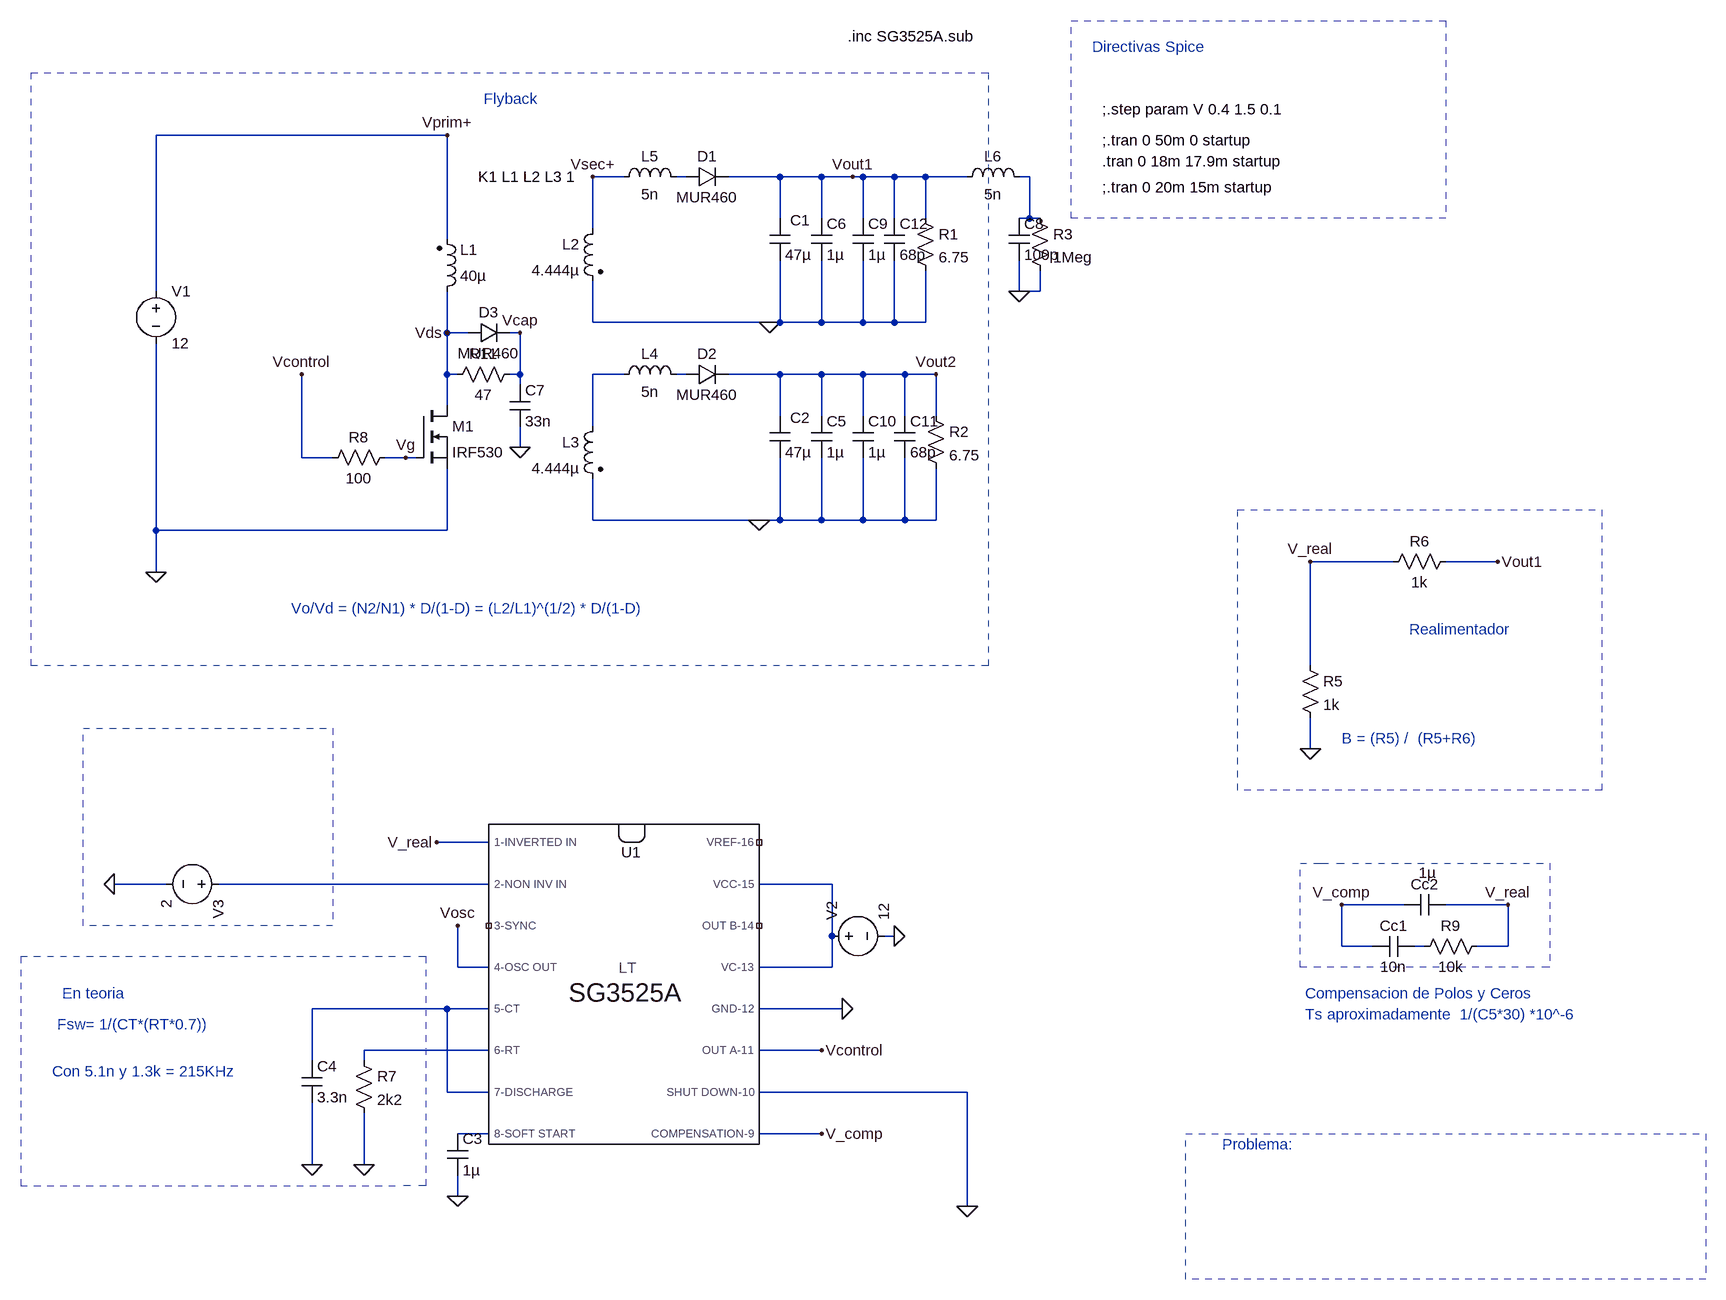
[diagram p0: schematic FlyBack_CL_realimentado_vref.asc]
FlyBack_CL_realimentado_vref.asc, the LTspice schematic file:
Version 4
SHEET 1 2728 2080
WIRE 48 -240 -400 -240
WIRE 320 -176 272 -176
WIRE 416 -176 400 -176
WIRE 560 -176 480 -176
WIRE 624 -176 560 -176
WIRE 672 -176 624 -176
WIRE 688 -176 672 -176
WIRE 736 -176 688 -176
WIRE 784 -176 736 -176
WIRE 848 -176 784 -176
WIRE 944 -176 928 -176
WIRE 560 -112 560 -176
WIRE 624 -112 624 -176
WIRE 688 -112 688 -176
WIRE 736 -112 736 -176
WIRE 784 -112 784 -176
WIRE 944 -112 944 -176
WIRE 944 -112 928 -112
WIRE 960 -112 944 -112
WIRE 272 -96 272 -176
WIRE 48 -80 48 -240
WIRE -400 0 -400 -240
WIRE 928 0 928 -48
WIRE 960 0 960 -32
WIRE 960 0 928 0
WIRE 272 48 272 -16
WIRE 544 48 272 48
WIRE 560 48 560 -48
WIRE 560 48 544 48
WIRE 624 48 624 -48
WIRE 624 48 560 48
WIRE 688 48 688 -48
WIRE 688 48 624 48
WIRE 736 48 736 -48
WIRE 736 48 688 48
WIRE 784 48 784 -32
WIRE 784 48 736 48
WIRE 48 64 48 0
WIRE 80 64 48 64
WIRE 160 64 144 64
WIRE 48 128 48 64
WIRE 64 128 48 128
WIRE 160 128 160 64
WIRE 160 128 144 128
WIRE 320 128 272 128
WIRE 416 128 400 128
WIRE 560 128 480 128
WIRE 624 128 560 128
WIRE 688 128 624 128
WIRE 752 128 688 128
WIRE 800 128 752 128
WIRE 160 144 160 128
WIRE 48 176 48 128
WIRE 560 192 560 128
WIRE 624 192 624 128
WIRE 688 192 688 128
WIRE 752 192 752 128
WIRE 800 192 800 128
WIRE 272 208 272 128
WIRE 160 240 160 208
WIRE -176 256 -176 128
WIRE -128 256 -176 256
WIRE -16 256 -48 256
WIRE 0 256 -16 256
WIRE 272 352 272 288
WIRE 528 352 272 352
WIRE 560 352 560 256
WIRE 560 352 528 352
WIRE 624 352 624 256
WIRE 624 352 560 352
WIRE 688 352 688 256
WIRE 688 352 624 352
WIRE 752 352 752 256
WIRE 752 352 688 352
WIRE 800 352 800 272
WIRE 800 352 752 352
WIRE -400 368 -400 80
WIRE 48 368 48 272
WIRE 48 368 -400 368
WIRE 1504 416 1376 416
WIRE 1664 416 1584 416
WIRE -400 432 -400 368
WIRE 1376 576 1376 416
WIRE 1376 704 1376 656
WIRE 112 848 32 848
WIRE -384 912 -464 912
WIRE 112 912 -304 912
WIRE 640 912 528 912
WIRE 1520 944 1424 944
WIRE 1680 944 1584 944
WIRE 640 992 640 912
WIRE 736 992 720 992
WIRE 1424 1008 1424 944
WIRE 1472 1008 1424 1008
WIRE 1552 1008 1536 1008
WIRE 1680 1008 1680 944
WIRE 1680 1008 1632 1008
WIRE 64 1040 64 976
WIRE 112 1040 64 1040
WIRE 640 1040 640 992
WIRE 640 1040 528 1040
WIRE 48 1104 -160 1104
WIRE 112 1104 48 1104
WIRE 656 1104 528 1104
WIRE 112 1168 -80 1168
WIRE 624 1168 528 1168
WIRE -160 1184 -160 1104
WIRE -80 1184 -80 1168
WIRE 48 1232 48 1104
WIRE 112 1232 48 1232
WIRE 848 1232 528 1232
WIRE 112 1296 64 1296
WIRE 624 1296 528 1296
WIRE -160 1344 -160 1248
WIRE -80 1344 -80 1264
WIRE 64 1392 64 1360
WIRE 848 1408 848 1232
FLAG -400 432 0
FLAG 672 -176 Vout1
FLAG 800 128 Vout2
FLAG 656 1104 0
FLAG -464 912 0
FLAG 1376 704 0
FLAG 1664 416 Vout1
FLAG 624 1168 Vcontrol
FLAG 848 1408 0
FLAG 64 1392 0
FLAG -80 1344 0
FLAG -160 1344 0
FLAG 736 992 0
FLAG 32 848 V_real
FLAG 1376 416 V_real
FLAG 1680 944 V_real
FLAG -176 128 Vcontrol
FLAG 624 1296 V_comp
FLAG 1424 944 V_comp
FLAG 160 240 0
FLAG 544 48 0
FLAG 528 352 0
FLAG 272 -176 Vsec+
FLAG 48 64 Vds
FLAG 160 64 Vcap
FLAG 48 -240 Vprim+
FLAG 64 976 Vosc
FLAG -16 256 Vg
FLAG 928 0 0
SYMBOL nmos 0 176 R0
SYMATTR InstName M1
SYMATTR Value IRF530
SYMBOL diode 416 -160 R270
WINDOW 0 32 32 VTop 2
WINDOW 3 0 32 VBottom 2
SYMATTR InstName D1
SYMATTR Value MUR460
SYMBOL voltage -400 -16 R0
WINDOW 123 0 0 Left 0
WINDOW 39 0 0 Left 0
SYMATTR InstName V1
SYMATTR Value 12
SYMBOL res -32 240 R90
WINDOW 0 0 56 VBottom 2
WINDOW 3 32 56 VTop 2
SYMATTR InstName R8
SYMATTR Value 100
SYMBOL cap 544 -112 R0
WINDOW 0 32 3 Left 2
SYMATTR InstName C1
SYMATTR Value 47µ
SYMATTR SpiceLine Rser=0.1
SYMBOL res 768 -128 R0
SYMATTR InstName R1
SYMATTR Value 6.75
SYMBOL ind2 32 16 M180
WINDOW 0 36 80 Left 2
WINDOW 3 36 40 Left 2
SYMATTR InstName L1
SYMATTR Value 40µ
SYMATTR Type ind
SYMBOL ind2 288 -112 M0
SYMATTR InstName L2
SYMATTR Value 4.444µ
SYMATTR Type ind
SYMBOL diode 416 144 R270
WINDOW 0 32 32 VTop 2
WINDOW 3 0 32 VBottom 2
SYMATTR InstName D2
SYMATTR Value MUR460
SYMBOL cap 544 192 R0
WINDOW 0 32 3 Left 2
SYMATTR InstName C2
SYMATTR Value 47µ
SYMATTR SpiceLine Rser=0.1
SYMBOL res 784 176 R0
SYMATTR InstName R2
SYMATTR Value 6.75
SYMBOL ind2 288 192 M0
SYMATTR InstName L3
SYMATTR Value 4.444µ
SYMATTR Type ind
SYMBOL res 1600 400 R90
WINDOW 0 0 56 VBottom 2
WINDOW 3 32 56 VTop 2
SYMATTR InstName R6
SYMATTR Value 1k
SYMBOL cap 48 1296 R0
SYMATTR InstName C3
SYMATTR Value 1µ
SYMBOL res -96 1168 R0
SYMATTR InstName R7
SYMATTR Value 2k2
SYMBOL cap -176 1184 R0
SYMATTR InstName C4
SYMATTR Value 3.3n
SYMBOL SG3525A 256 944 R0
SYMATTR InstName U1
SYMATTR Value SG3525A
SYMBOL cap 1536 992 R90
WINDOW 0 0 32 VBottom 2
WINDOW 3 32 32 VTop 2
SYMATTR InstName Cc1
SYMATTR Value 10n
SYMBOL res 1648 992 R90
WINDOW 0 0 56 VBottom 2
WINDOW 3 32 56 VTop 2
SYMATTR InstName R9
SYMATTR Value 10k
SYMBOL cap 1584 928 R90
WINDOW 0 0 32 VBottom 2
WINDOW 3 -49 28 VTop 2
SYMATTR InstName Cc2
SYMATTR Value 1µ
SYMBOL voltage 624 992 R270
WINDOW 123 0 0 Left 0
WINDOW 39 0 0 Left 0
SYMATTR InstName V2
SYMATTR Value 12
SYMBOL res 1360 560 R0
SYMATTR InstName R5
SYMATTR Value 1k
SYMBOL diode 80 80 R270
WINDOW 0 32 32 VTop 2
WINDOW 3 0 32 VBottom 2
SYMATTR InstName D3
SYMATTR Value MUR460
SYMBOL cap 144 144 R0
SYMATTR InstName C7
SYMATTR Value 33n
SYMBOL res 160 112 R90
WINDOW 0 0 56 VBottom 2
WINDOW 3 32 56 VTop 2
SYMATTR InstName R11
SYMATTR Value 47
SYMBOL cap 608 192 R0
SYMATTR InstName C5
SYMATTR Value 1µ
SYMATTR SpiceLine Rser=0.1
SYMBOL cap 608 -112 R0
SYMATTR InstName C6
SYMATTR Value 1µ
SYMATTR SpiceLine Rser=0.1
SYMBOL voltage -288 912 R90
WINDOW 123 0 0 Left 0
WINDOW 39 0 0 Left 0
SYMATTR InstName V3
SYMATTR Value 2
SYMBOL ind 304 144 R270
WINDOW 0 32 56 VTop 2
WINDOW 3 5 56 VBottom 2
SYMATTR InstName L4
SYMATTR Value 5n
SYMATTR SpiceLine Rser=0.016
SYMBOL ind 304 -160 R270
WINDOW 0 32 56 VTop 2
WINDOW 3 5 56 VBottom 2
SYMATTR InstName L5
SYMATTR Value 5n
SYMATTR SpiceLine Rser=0.016
SYMBOL cap 912 -112 R0
SYMATTR InstName C8
SYMATTR Value 100p
SYMBOL res 944 -128 R0
SYMATTR InstName R3
SYMATTR Value 1Meg
SYMBOL ind 832 -160 R270
WINDOW 0 32 56 VTop 2
WINDOW 3 5 56 VBottom 2
SYMATTR InstName L6
SYMATTR Value 5n
SYMBOL cap 672 -112 R0
SYMATTR InstName C9
SYMATTR Value 1µ
SYMATTR SpiceLine Rser=0.1
SYMBOL cap 672 192 R0
SYMATTR InstName C10
SYMATTR Value 1µ
SYMATTR SpiceLine Rser=0.1
SYMBOL cap 736 192 R0
SYMATTR InstName C11
SYMATTR Value 68p
SYMATTR SpiceLine Rser=0.01
SYMBOL cap 720 -112 R0
SYMATTR InstName C12
SYMATTR Value 68p
SYMATTR SpiceLine Rser=0.01
TEXT -192 488 Left 2 ;Vo/Vd = (N2/N1) * D/(1-D) = (L2/L1)^(1/2) * D/(1-D)
TEXT 96 -176 Left 2 !K1 L1 L2 L3 1
TEXT 1056 -232 Left 2 !;.tran 0 50m 0 startup
TEXT 664 -392 Left 2 !.inc SG3525A.sub
TEXT 1368 1080 Left 2 ;Compensacion de Polos y Ceros
TEXT 1368 1112 Left 2 ;Ts aproximadamente  1/(C5*30) *10^-6
TEXT 1056 -280 Left 2 !;.step param V 0.4 1.5 0.1
TEXT -544 1080 Left 2 ;En teoria
TEXT -552 1128 Left 2 ;Fsw= 1/(CT*(RT*0.7))
TEXT -560 1200 Left 2 ;Con 5.1n y 1.3k = 215KHz
TEXT 1528 520 Left 2 ;Realimentador
TEXT 1424 688 Left 2 ;B = (R5) /  (R5+R6)
TEXT 104 -296 Left 2 ;Flyback
TEXT 1040 -376 Left 2 ;Directivas Spice
TEXT 1240 1312 Left 2 ;Problema:
TEXT 1056 -160 Left 2 !;.tran 0 20m 15m startup
TEXT 1056 -200 Left 2 !.tran 0 18m 17.9m startup
LINE Normal 16 1376 16 1024 2
LINE Normal -608 1376 -32 1376 2
LINE Normal -608 1024 -608 1376 2
LINE Normal -32 1024 -608 1024 2
LINE Normal 1696 1040 1392 1040 2
LINE Normal 1744 880 1744 1040 2
LINE Normal 1440 880 1744 880 2
LINE Normal 1392 880 1440 880 2
LINE Normal 1744 1040 1696 1040 2
LINE Normal 1360 880 1392 880 2
LINE Normal 1360 1040 1360 880 2
LINE Normal 1392 1040 1360 1040 2
LINE Normal 16 1024 -32 1024 2
LINE Normal 16 1376 -32 1376 2
RECTANGLE Normal 1824 768 1264 336 2
RECTANGLE Normal 880 576 -592 -336 2
RECTANGLE Normal -128 976 -512 672 2
RECTANGLE Normal 1584 -112 1008 -416 2
RECTANGLE Normal 1984 1520 1184 1296 2

The netlist it stands for:
* FlyBack_CL_realimentado_vref.asc
M1 Vds Vg 0 0 IRF530
D1 N001 Vout1 MUR460
V1 Vprim+ 0 12
R8 Vg Vcontrol 100
C1 Vout1 0 47µ Rser=0.1
R1 Vout1 0 6.75
L1 Vds Vprim+ 40µ
L2 Vsec+ 0 4.444µ
D2 N004 Vout2 MUR460
C2 Vout2 0 47µ Rser=0.1
R2 Vout2 0 6.75
L3 N003 0 4.444µ
R6 Vout1 V_real 1k
C3 N010 0 1µ
R7 N009 0 2k2
C4 N008 0 3.3n
XU1 V_real N005 NC_01 Vosc N008 N009 N008 N010 V_comp 0 Vcontrol 0 N006 NC_02 N006 NC_03 SG3525A  ; pins 1-INVERTED_IN 2-NON_INV_IN 3-SYNC 4-OSC_OUT 5-CT 6-RT 7-DISCHARGE 8-SOFT_START COMPENSATION-9 SHUT_DOWN-10 OUT_A-11 GND-12 VC-13 OUT_B-14 VCC-15 VREF-16
Cc1 N007 V_comp 10n
R9 V_real N007 10k
Cc2 V_real V_comp 1µ
V2 N006 0 12
R5 V_real 0 1k
D3 Vds Vcap MUR460
C7 Vcap 0 33n
R11 Vcap Vds 47
C5 Vout2 0 1µ Rser=0.1
C6 Vout1 0 1µ Rser=0.1
V3 N005 0 2
L4 N003 N004 5n Rser=0.016
L5 Vsec+ N001 5n Rser=0.016
C8 N002 0 100p
R3 N002 0 1Meg
L6 Vout1 N002 5n
C9 Vout1 0 1µ Rser=0.1
C10 Vout2 0 1µ Rser=0.1
C11 Vout2 0 68p Rser=0.01
C12 Vout1 0 68p Rser=0.01
.model D D
.lib standard.dio
.model NMOS NMOS
.model PMOS PMOS
.lib standard.mos
* Vo/Vd = (N2/N1) * D/(1-D) = (L2/L1)^(1/2) * D/(1-D)
K1 L1 L2 L3 1
;.tran 0 50m 0 startup
.inc SG3525A.sub
* Compensacion de Polos y Ceros
* Ts aproximadamente  1/(C5*30) *10^-6
;.step param V 0.4 1.5 0.1
* En teoria
* Fsw= 1/(CT*(RT*0.7))
* Con 5.1n y 1.3k = 215KHz
* Realimentador
* B = (R5) /  (R5+R6)
* Flyback
* Directivas Spice
* Problema:
;.tran 0 20m 15m startup
.tran 0 18m 17.9m startup
.backanno
.end